# Altium schematic sheet Tiva_C_Base.SchDoc
size B
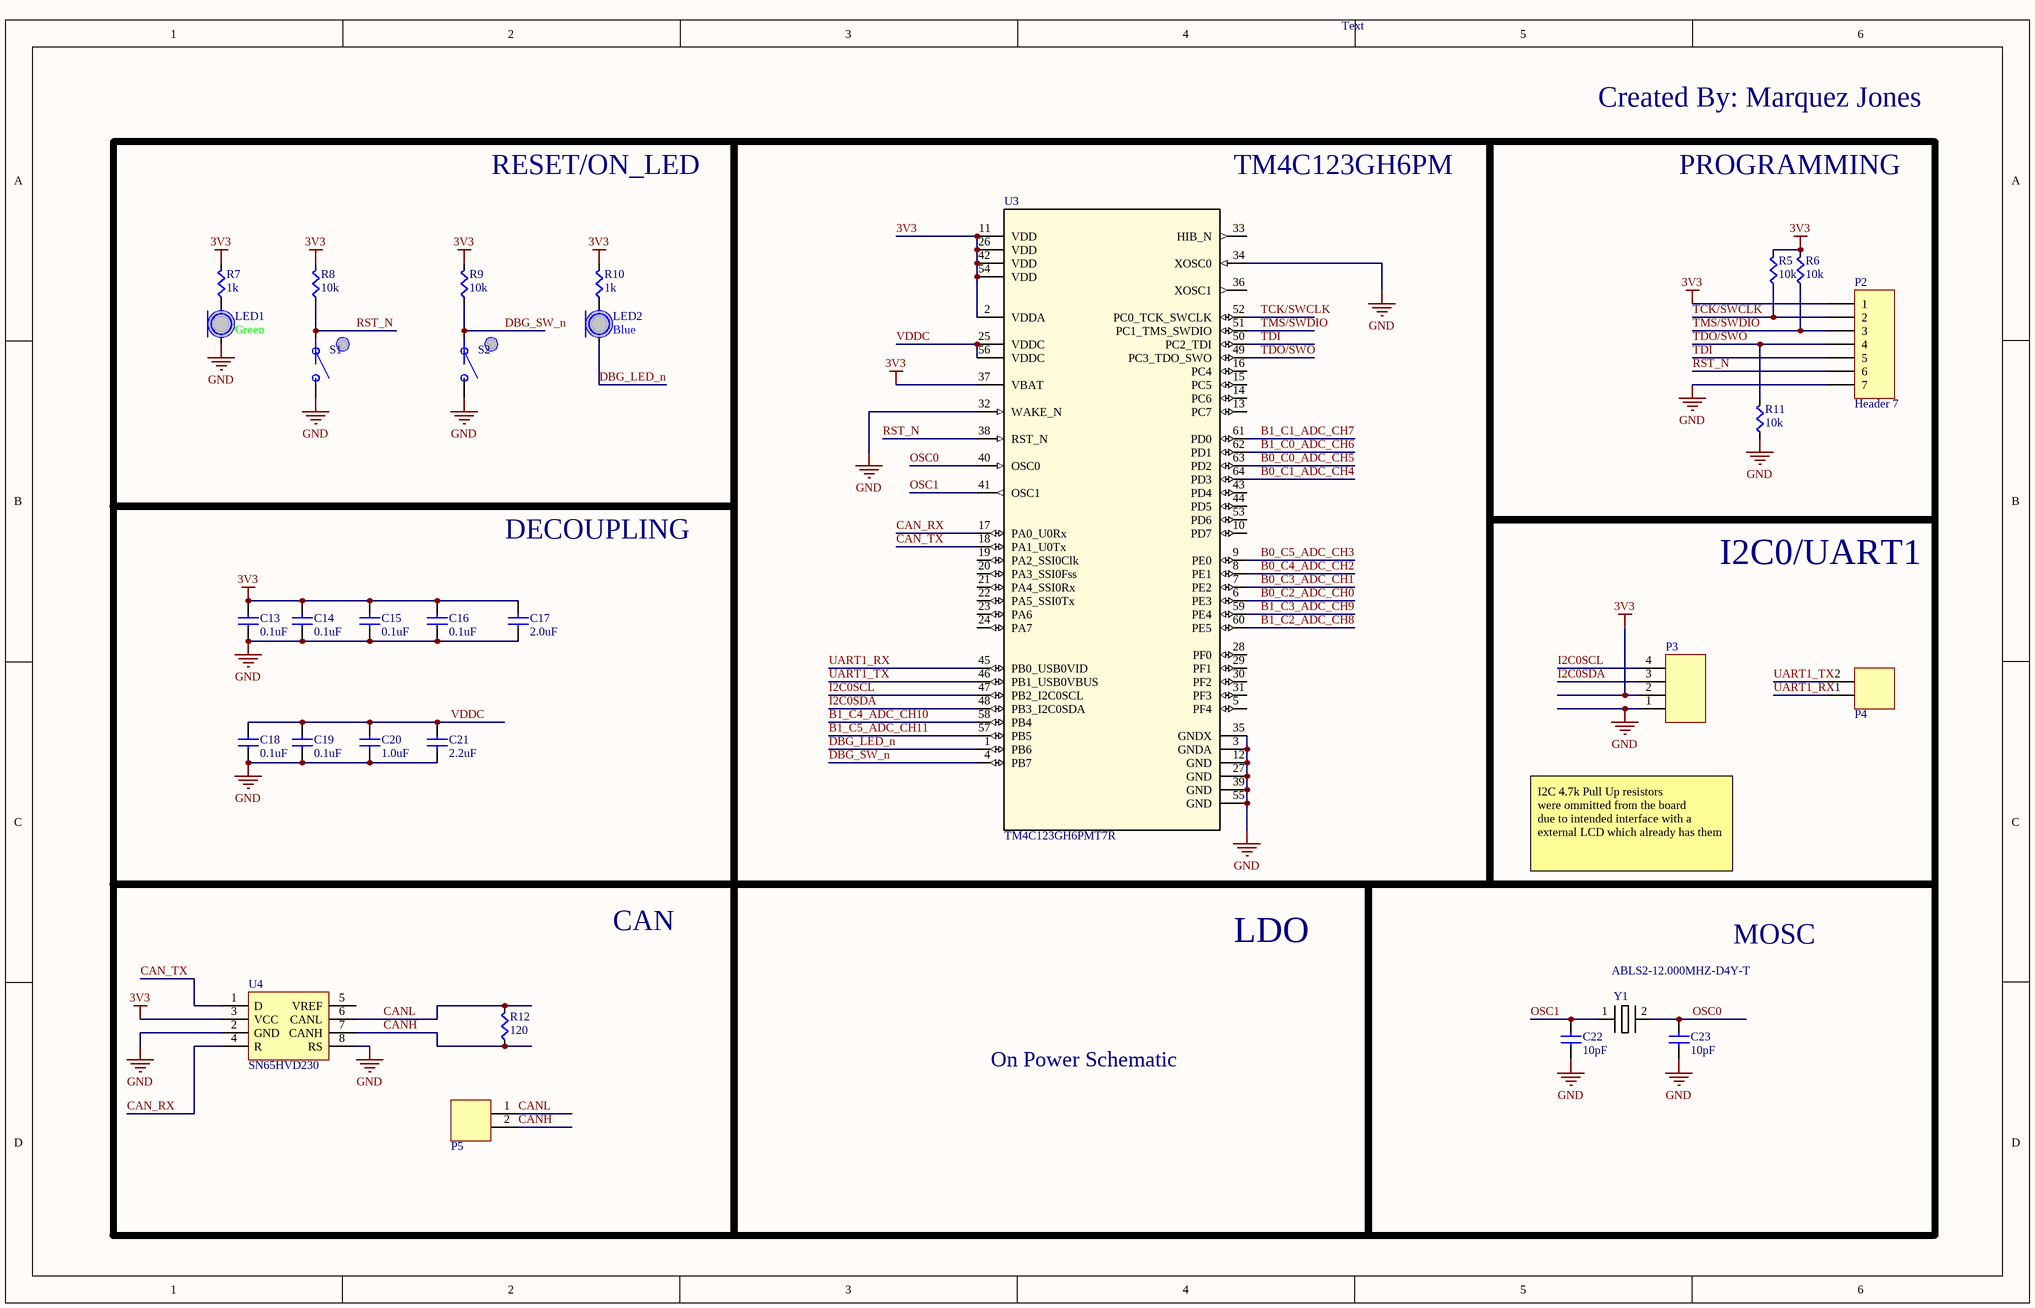
[diagram p0: Tiva_C_Base.SchDoc]

## Parts
C13  value 0.1uF  [CAPC0603]  (hidden comment: Cap)
C14  value 0.1uF  [CAPC0603]  (hidden comment: Cap)
C15  value 0.1uF  [CAPC0603]  (hidden comment: Cap)
C16  value 0.1uF  [CAPC0603]  (hidden comment: Cap)
C17  value 2.0uF  [CAPC0603]  (hidden comment: Cap)
C18  value 0.1uF  [CAPC0603]  (hidden comment: Cap)
C19  value 0.1uF  [CAPC0603]  (hidden comment: Cap)
C20  value 1.0uF  [CAPC0603]  (hidden comment: Cap)
C21  value 2.2uF  [CAPC0603]  (hidden comment: Cap)
C22  value 10pF  [CAPC0603]  (hidden comment: Cap)
C23  value 10pF  [CAPC0603]  (hidden comment: Cap)
LED1  Color: Green  [LED0603]  (hidden comment: LED)
LED2  Color: Blue  [LED0603]  (hidden comment: LED)
P2  Header 7  [HDR1X7]
P3  (no value)  [MOLEX-HDR-1X4-SHERLOCK-VERT]
P4  2-pin Vert Sherlock  [MOLEX-HDR-1X2-SHERLOCK-VERT]  (value not drawn)
P5  2-pin Vert Sherlock  [MOLEX-HDR-1X2-SHERLOCK-VERT]  (value not drawn)
R5  value 10k  [RES0603]  (hidden comment: Res)
R6  value 10k  [RES0603]  (hidden comment: Res)
R7  value 1k  [RES0603]  (hidden comment: Res)
R8  value 10k  [RES0603]  (hidden comment: Res)
R9  value 10k  [RES0603]  (hidden comment: Res)
R10  value 1k  [RES0603]  (hidden comment: Res)
R11  value 10k  [RES0603]  (hidden comment: Res)
R12  value 120  [RES0603]  (hidden comment: Res)
S1  Button  [PTS645xxxxSMTR92]  (value not drawn)
S2  Button  [PTS645xxxxSMTR92]  (value not drawn)
U3  TM4C123GH6PMT7R  [TM4C123GH6PMT7R_L]
U4  SN65HVD230  [SOIC-8pin]
Y1  ABLS2-12.000MHZ-D4Y-T  [HC49/US]

## Blocks framed on the sheet
RESET/ON_LED: LED1 LED2 R7-R10 S1 S2
TM4C123GH6PM: U3
PROGRAMMING: P2 R5 R6 R11
DECOUPLING: C13-C21
I2C0/UART1: P3 P4
CAN: P5 R12 U4
MOSC: C22 C23 Y1

## Nets
3V3: C13.1(A) C14.1(A) C15.1(A) C16.1(A) C17.1(A) P2.1 P3.2 R5.1(A) R6.1(A) R7.1(A) R8.1(A) R9.1(A) R10.1(A) U3.2(VDDA) U3.11(VDD) U3.26(VDD) U3.37(VBAT) U3.42(VDD) U3.54(VDD) U4.3(VCC)
GND: C13.2(B) C14.2(B) C15.2(B) C16.2(B) C17.2(B) C18.2(B) C19.2(B) C20.2(B) C21.2(B) C22.2(B) C23.2(B) LED1.C P2.7 P3.1 R11.2(B) S1.B S2.B U3.3(GNDA) U3.12(GND) U3.27(GND) U3.32(WAKE_N) U3.34(XOSC0) U3.35(GNDX) U3.39(GND) U3.55(GND) U4.2(GND) U4.8(RS)
B0_C0_ADC_CH5: U3.63(PD2)
B0_C1_ADC_CH4: U3.64(PD3)
B0_C2_ADC_CH0: U3.6(PE3)
B0_C3_ADC_CH1: U3.7(PE2)
B0_C4_ADC_CH2: U3.8(PE1)
B0_C5_ADC_CH3: U3.9(PE0)
B1_C0_ADC_CH6: U3.62(PD1)
B1_C1_ADC_CH7: U3.61(PD0)
B1_C2_ADC_CH8: U3.60(PE5)
B1_C3_ADC_CH9: U3.59(PE4)
B1_C4_ADC_CH10: U3.58(PB4)
B1_C5_ADC_CH11: U3.57(PB5)
CAN_RX: U3.17(PA0_U0Rx) U4.4(R)
CAN_TX: U3.18(PA1_U0Tx) U4.1(D)
CANH: P5.2 R12.2(B) U4.7(CANH)
CANL: P5.1 R12.1(A) U4.6(CANL)
DBG_LED_n: LED2.C U3.1(PB6)
DBG_SW_n: R9.2(B) S2.A U3.4(PB7)
I2C0SCL: P3.4 U3.47(PB2_I2C0SCL)
I2C0SDA: P3.3 U3.48(PB3_I2C0SDA)
OSC0: C23.1(A) U3.40(OSC0) Y1.2
OSC1: C22.1(A) U3.41(OSC1) Y1.1
RST_N: P2.6 R8.2(B) S1.A U3.38(RST_N)
TCK/SWCLK: P2.2 R5.2(B) U3.52(PC0_TCK_SWCLK)
TDI: P2.5 U3.50(PC2_TDI)
TDO/SWO: P2.4 R11.1(A) U3.49(PC3_TDO_SWO)
TMS/SWDIO: P2.3 R6.2(B) U3.51(PC1_TMS_SWDIO)
UART1_RX: P4.1 U3.45(PB0_USB0VID)
UART1_TX: P4.2 U3.46(PB1_USB0VBUS)
VDDC: C18.1(A) C19.1(A) C20.1(A) C21.1(A) U3.25(VDDC) U3.56(VDDC)
NetLED1_A: LED1.A R7.2(B)
NetLED2_A: LED2.A R10.2(B)

Not connected (* = marked no-connect by the designer): U3 5(PF4) 10(PD7) 13(PC7) 14(PC6) 15(PC5) 16(PC4) 19(PA2_SSI0Clk) 20(PA3_SSI0Fss) 21(PA4_SSI0Rx) 22(PA5_SSI0Tx) 23(PA6) 24(PA7) 28(PF0) 29(PF1) 30(PF2) 31(PF3) 33(HIB_N) 36(XOSC1) 43(PD4) 44(PD5) 53(PD6); U4 5(VREF)

## Notes on the sheet
- Text
- Created By: Marquez Jones
- I2C 4.7k Pull Up resistors
  were ommitted from the board
  due to intended interface with a
  external LCD which already has them
- LDO
- On Power Schematic

## Library data of the parts
P2 = Header 7: Header, 7-Pin; LatestRevisionDate: 17-Jul-2002; LatestRevisionNote: Re-released for DXP Platform.; Publisher: Altium Limited
P3 = MOLEX-HDR-1x4-SHERLOCK_VERT: Header, Molex, 2mm Pitch Sherlock Header, Single Row, Vertical, 4 Circuits, Length 3.3mm, 0353620450; Manufacturer Part Number: *; Order Part Number: *
P4 P5 = MOLEX-HDR-1x2-SHERLOCK_VERT: Header, Molex, 2mm Pitch Sherlock Header, Single Row, Vertical, 2 Circuits, Length 3.3mm, 0353620250; Manufacturer Part Number: *; Order Part Number: *
S1 S2 = Button: SPST Button; Supplier 1: Digi-Key; Supplier Part Number 1: CKN9087CT-ND
U3 = TM4C123GH6PMT7R: Imported; PartNumber: TM4C123GH6PMTR; Manufacturer: Texas Instruments; CompType: IC; PIN_COUNT: 64; Application_BuildNumber: *; Alternate_PartNumber: TM4C123GH6PMT; PackageReference: PM0064A; MountType: SMT; RoHS: Y; RefDes: RefDes; TYPE: TYPE; Value: Value
U4 = SN65HVD230: 3.3V CAN Bus Transceiver
Y1 = ABLS2-12.000MHZ-D4Y-T: 12MHz ±30ppm Crystal 18pF 50 Ohm -40°C ~ 85°C Surface Mount HC49/US; Supplier 1: Digi-Key; Supplier Part Number 1: 535-9869-1-ND
C13-C23 = Cap: Supplier 1: Digi-Key; Supplier Part Number 1: 1276-1000-1-ND
LED1 LED2 = LED: Supplier 1: Digi-Key; Supplier Part Number 1: 754-1122-1-ND
R5-R12 = Res: Supplier 1: Digi-Key; Supplier Part Number 1: RMCF0603JT10K0CT-ND